# EAGLE design PGTN_daisy2_main_12cvin (EAGLE 9.6.0)
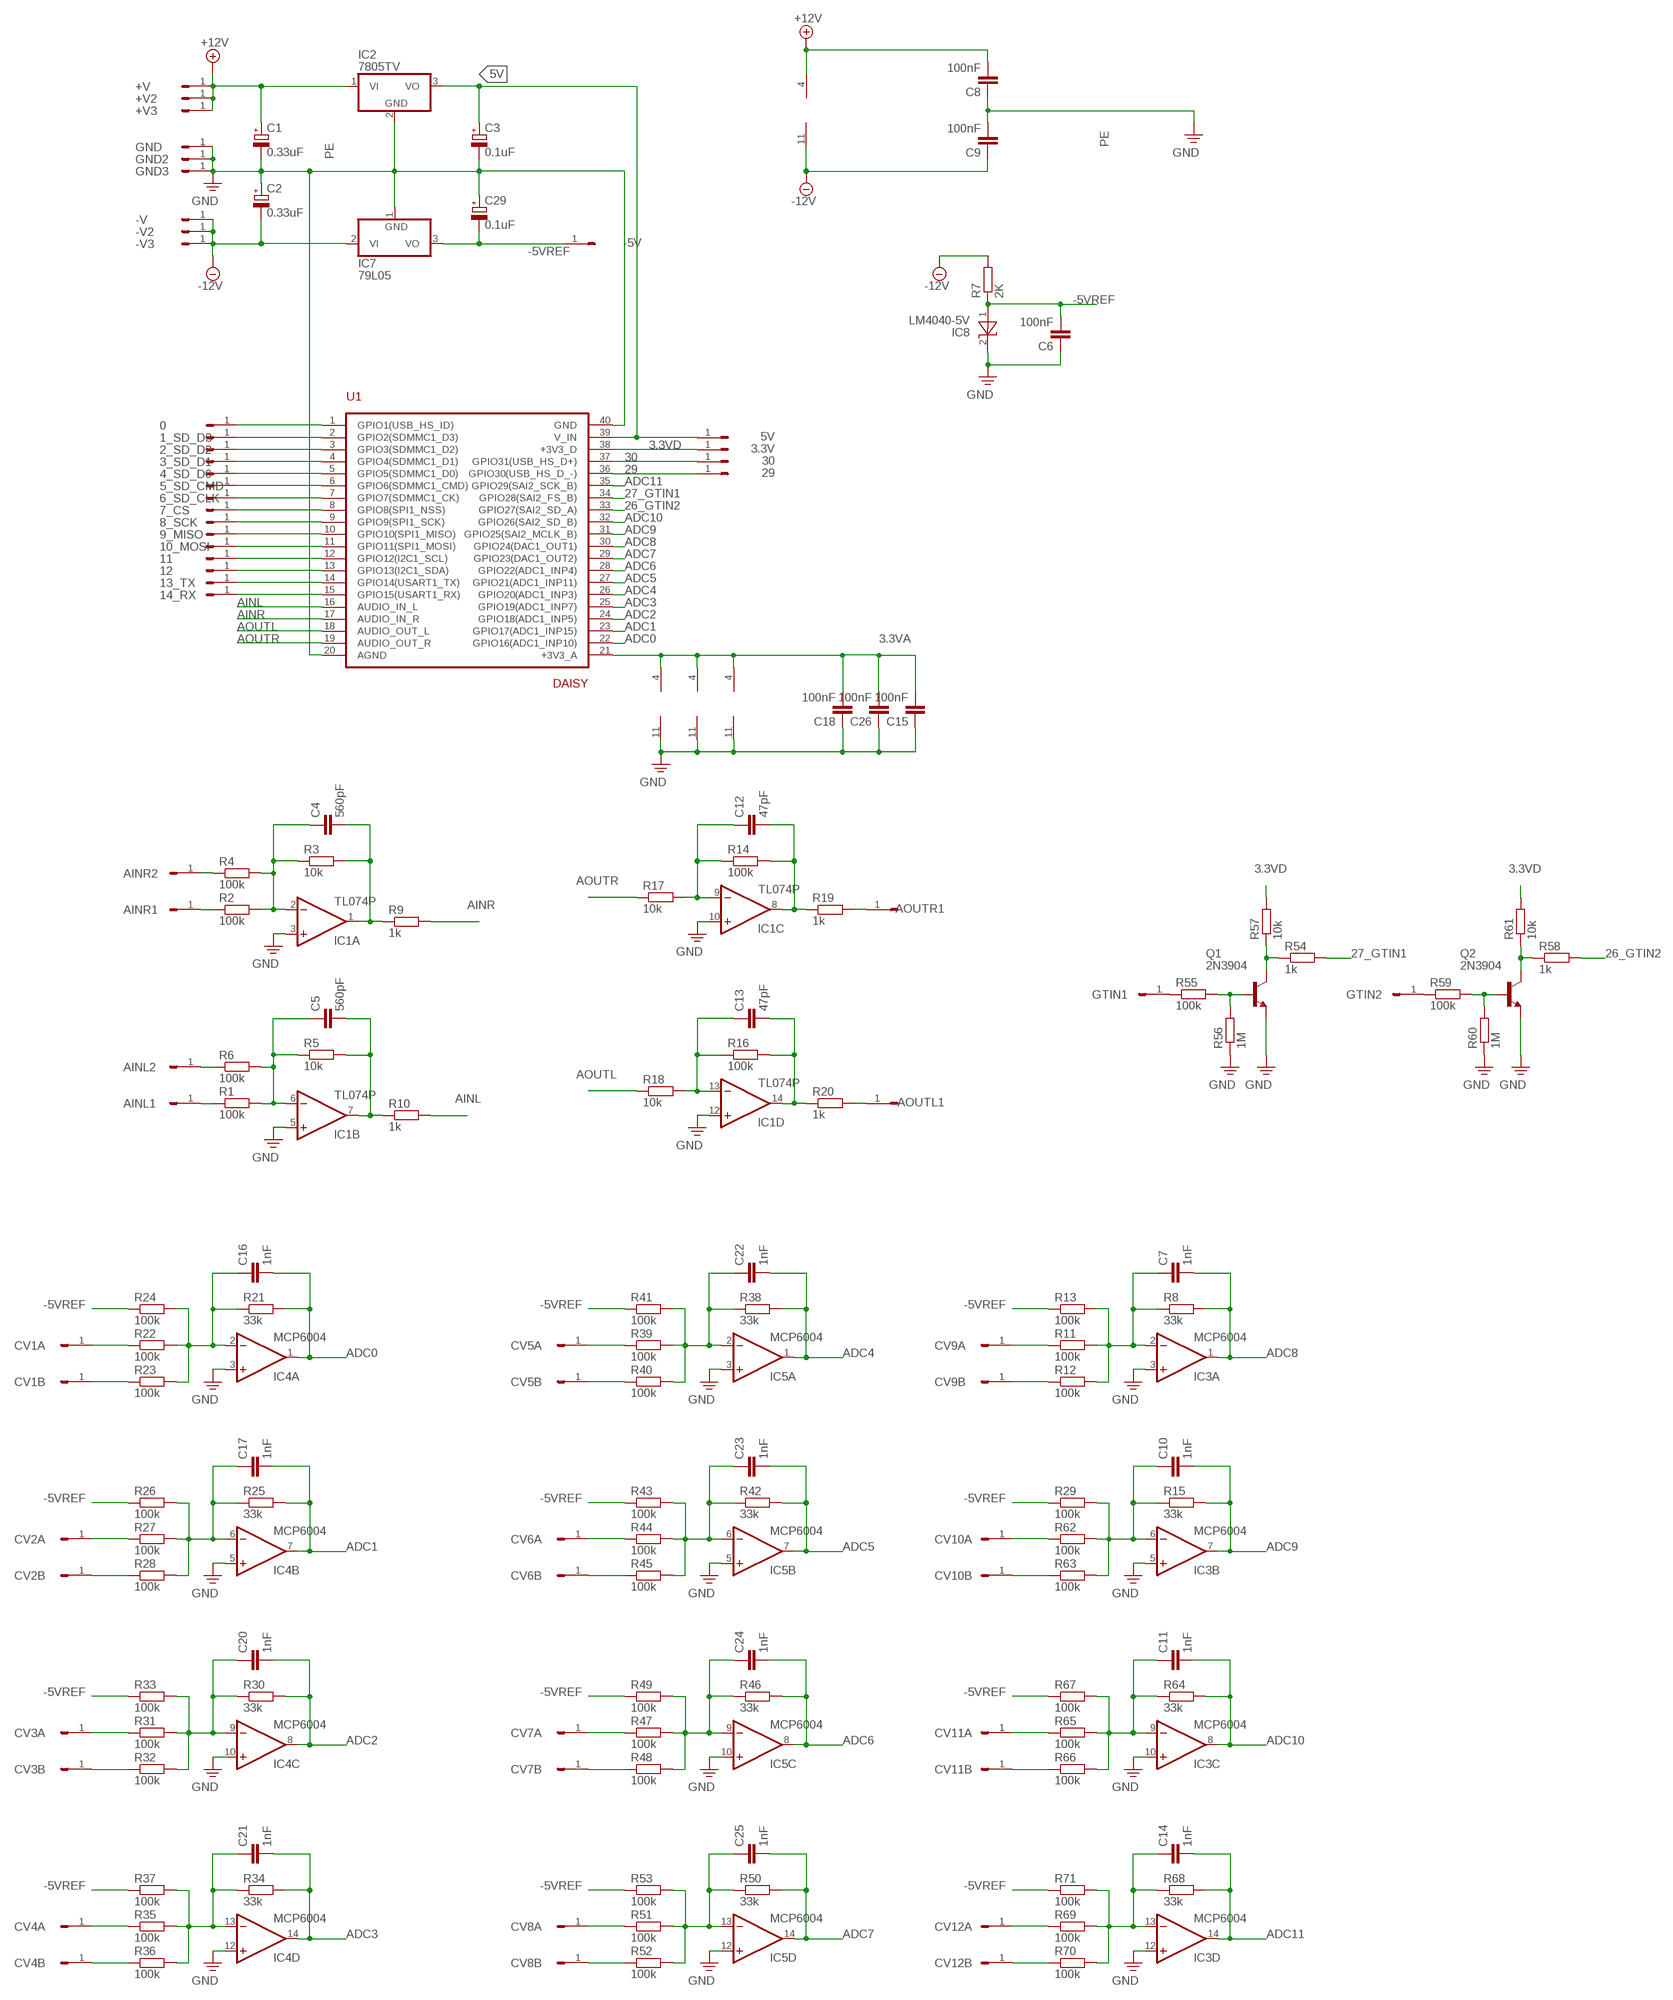
[diagram p0: schematic, sheet 1]

## Parts
0  HEADER/MALE/01  [HEADER/MALE/01]
1_SD_D3  HEADER/MALE/01  [HEADER/MALE/01]
2_SD_D2  HEADER/MALE/01  [HEADER/MALE/01]
3.3V  HEADER/MALE/01  [HEADER/MALE/01]
3_SD_D1  HEADER/MALE/01  [HEADER/MALE/01]
4_SD_D0  HEADER/MALE/01  [HEADER/MALE/01]
5_SD_CMD  HEADER/MALE/01  [HEADER/MALE/01]
5V  HEADER/MALE/01  [HEADER/MALE/01]
6_SD_CLK  HEADER/MALE/01  [HEADER/MALE/01]
7_CS  HEADER/MALE/01  [HEADER/MALE/01]
8_SCK  HEADER/MALE/01  [HEADER/MALE/01]
9_MISO  HEADER/MALE/01  [HEADER/MALE/01]
10_MOSI  HEADER/MALE/01  [HEADER/MALE/01]
11  HEADER/MALE/01  [HEADER/MALE/01]
12  HEADER/MALE/01  [HEADER/MALE/01]
13_TX  HEADER/MALE/01  [HEADER/MALE/01]
14_RX  HEADER/MALE/01  [HEADER/MALE/01]
29  HEADER/MALE/01  [HEADER/MALE/01]
30  HEADER/MALE/01  [HEADER/MALE/01]
+V  HEADER/MALE/01  [HEADER/MALE/01]
+V2  HEADER/MALE/01  [HEADER/MALE/01]
+V3  HEADER/MALE/01  [HEADER/MALE/01]
-5V  HEADER/MALE/01  [HEADER/MALE/01]
-V  HEADER/MALE/01  [HEADER/MALE/01]
-V2  HEADER/MALE/01  [HEADER/MALE/01]
-V3  HEADER/MALE/01  [HEADER/MALE/01]
AINL1  HEADER/MALE/01  [HEADER/MALE/01]
AINL2  HEADER/MALE/01  [HEADER/MALE/01]
AINR1  HEADER/MALE/01  [HEADER/MALE/01]
AINR2  HEADER/MALE/01  [HEADER/MALE/01]
AOUTL1  HEADER/MALE/01  [HEADER/MALE/01]
AOUTR1  HEADER/MALE/01  [HEADER/MALE/01]
C1  0.33uF  CAPACITOR/POLARIZEDE2.5-6  [E2,5-6]
C2  0.33uF  CAPACITOR/POLARIZEDE2.5-6  [E2,5-6]
C3  0.1uF  CAPACITOR/POLARIZEDE2.5-6  [E2,5-6]
C4  560pF  CAPACITORCERAMICDISC/5  [CERAMICDISC/5]
C5  560pF  CAPACITORCERAMICDISC/5  [CERAMICDISC/5]
C6  100nF  CAPACITORCERAMICDISC/5  [CERAMICDISC/5]
C7  1nF  CAPACITORCERAMICDISC/5  [CERAMICDISC/5]
C8  100nF  CAPACITORCERAMICDISC/5  [CERAMICDISC/5]
C9  100nF  CAPACITORCERAMICDISC/5  [CERAMICDISC/5]
C10  1nF  CAPACITORCERAMICDISC/5  [CERAMICDISC/5]
C11  1nF  CAPACITORCERAMICDISC/5  [CERAMICDISC/5]
C12  47pF  CAPACITORCERAMICDISC/5  [CERAMICDISC/5]
C13  47pF  CAPACITORCERAMICDISC/5  [CERAMICDISC/5]
C14  1nF  CAPACITORCERAMICDISC/5  [CERAMICDISC/5]
C15  100nF  CAPACITORCERAMICDISC/5  [CERAMICDISC/5]
C16  1nF  CAPACITORCERAMICDISC/5  [CERAMICDISC/5]
C17  1nF  CAPACITORCERAMICDISC/5  [CERAMICDISC/5]
C18  100nF  CAPACITORCERAMICDISC/5  [CERAMICDISC/5]
C20  1nF  CAPACITORCERAMICDISC/5  [CERAMICDISC/5]
C21  1nF  CAPACITORCERAMICDISC/5  [CERAMICDISC/5]
C22  1nF  CAPACITORCERAMICDISC/5  [CERAMICDISC/5]
C23  1nF  CAPACITORCERAMICDISC/5  [CERAMICDISC/5]
C24  1nF  CAPACITORCERAMICDISC/5  [CERAMICDISC/5]
C25  1nF  CAPACITORCERAMICDISC/5  [CERAMICDISC/5]
C26  100nF  CAPACITORCERAMICDISC/5  [CERAMICDISC/5]
C29  0.1uF  CAPACITOR/POLARIZEDE2.5-6  [E2,5-6]
CV1A  HEADER/MALE/01  [HEADER/MALE/01]
CV1B  HEADER/MALE/01  [HEADER/MALE/01]
CV2A  HEADER/MALE/01  [HEADER/MALE/01]
CV2B  HEADER/MALE/01  [HEADER/MALE/01]
CV3A  HEADER/MALE/01  [HEADER/MALE/01]
CV3B  HEADER/MALE/01  [HEADER/MALE/01]
CV4A  HEADER/MALE/01  [HEADER/MALE/01]
CV4B  HEADER/MALE/01  [HEADER/MALE/01]
CV5A  HEADER/MALE/01  [HEADER/MALE/01]
CV5B  HEADER/MALE/01  [HEADER/MALE/01]
CV6A  HEADER/MALE/01  [HEADER/MALE/01]
CV6B  HEADER/MALE/01  [HEADER/MALE/01]
CV7A  HEADER/MALE/01  [HEADER/MALE/01]
CV7B  HEADER/MALE/01  [HEADER/MALE/01]
CV8A  HEADER/MALE/01  [HEADER/MALE/01]
CV8B  HEADER/MALE/01  [HEADER/MALE/01]
CV9A  HEADER/MALE/01  [HEADER/MALE/01]
CV9B  HEADER/MALE/01  [HEADER/MALE/01]
CV10A  HEADER/MALE/01  [HEADER/MALE/01]
CV10B  HEADER/MALE/01  [HEADER/MALE/01]
CV11A  HEADER/MALE/01  [HEADER/MALE/01]
CV11B  HEADER/MALE/01  [HEADER/MALE/01]
CV12A  HEADER/MALE/01  [HEADER/MALE/01]
CV12B  HEADER/MALE/01  [HEADER/MALE/01]
GND  HEADER/MALE/01  [HEADER/MALE/01]
GND2  HEADER/MALE/01  [HEADER/MALE/01]
GND3  HEADER/MALE/01  [HEADER/MALE/01]
GTIN1  HEADER/MALE/01  [HEADER/MALE/01]
GTIN2  HEADER/MALE/01  [HEADER/MALE/01]
IC1  TL074P  [DIL14]
IC2  7805TV  [TO220V]
IC3  MCP6004  TL074P  [DIL14]
IC4  MCP6004  TL074P  [DIL14]
IC5  MCP6004  TL074P  [DIL14]
IC7  79L05  79L05Z  [TO92]
IC8  LM4040-5V  LM4040  [TO92]
Q1  2N3904  [TO92]
Q2  2N3904  [TO92]
R1  100k  RESISTORRESISTOR/UPRIGHT/7.5  [RESISTOR/7.5]
R2  100k  RESISTORRESISTOR/UPRIGHT/7.5  [RESISTOR/7.5]
R3  10k  RESISTORRESISTOR/UPRIGHT/7.5  [RESISTOR/7.5]
R4  100k  RESISTORRESISTOR/UPRIGHT/7.5  [RESISTOR/7.5]
R5  10k  RESISTORRESISTOR/UPRIGHT/7.5  [RESISTOR/7.5]
R6  100k  RESISTORRESISTOR/UPRIGHT/7.5  [RESISTOR/7.5]
R7  2K  RESISTORRESISTOR/UPRIGHT/7.5  [RESISTOR/7.5]
R8  33k  RESISTORRESISTOR/UPRIGHT/7.5  [RESISTOR/7.5]
R9  1k  RESISTORRESISTOR/UPRIGHT/7.5  [RESISTOR/7.5]
R10  1k  RESISTORRESISTOR/UPRIGHT/7.5  [RESISTOR/7.5]
R11  100k  RESISTORRESISTOR/UPRIGHT/7.5  [RESISTOR/7.5]
R12  100k  RESISTORRESISTOR/UPRIGHT/7.5  [RESISTOR/7.5]
R13  100k  RESISTORRESISTOR/UPRIGHT/7.5  [RESISTOR/7.5]
R14  100k  RESISTORRESISTOR/UPRIGHT/7.5  [RESISTOR/7.5]
R15  33k  RESISTORRESISTOR/UPRIGHT/7.5  [RESISTOR/7.5]
R16  100k  RESISTORRESISTOR/UPRIGHT/7.5  [RESISTOR/7.5]
R17  10k  RESISTORRESISTOR/UPRIGHT/7.5  [RESISTOR/7.5]
R18  10k  RESISTORRESISTOR/UPRIGHT/7.5  [RESISTOR/7.5]
R19  1k  RESISTORRESISTOR/UPRIGHT/7.5  [RESISTOR/7.5]
R20  1k  RESISTORRESISTOR/UPRIGHT/7.5  [RESISTOR/7.5]
R21  33k  RESISTORRESISTOR/UPRIGHT/7.5  [RESISTOR/7.5]
R22  100k  RESISTORRESISTOR/UPRIGHT/7.5  [RESISTOR/7.5]
R23  100k  RESISTORRESISTOR/UPRIGHT/7.5  [RESISTOR/7.5]
R24  100k  RESISTORRESISTOR/UPRIGHT/7.5  [RESISTOR/7.5]
R25  33k  RESISTORRESISTOR/UPRIGHT/7.5  [RESISTOR/7.5]
R26  100k  RESISTORRESISTOR/UPRIGHT/7.5  [RESISTOR/7.5]
R27  100k  RESISTORRESISTOR/UPRIGHT/7.5  [RESISTOR/7.5]
R28  100k  RESISTORRESISTOR/UPRIGHT/7.5  [RESISTOR/7.5]
R29  100k  RESISTORRESISTOR/UPRIGHT/7.5  [RESISTOR/7.5]
R30  33k  RESISTORRESISTOR/UPRIGHT/7.5  [RESISTOR/7.5]
R31  100k  RESISTORRESISTOR/UPRIGHT/7.5  [RESISTOR/7.5]
R32  100k  RESISTORRESISTOR/UPRIGHT/7.5  [RESISTOR/7.5]
R33  100k  RESISTORRESISTOR/UPRIGHT/7.5  [RESISTOR/7.5]
R34  33k  RESISTORRESISTOR/UPRIGHT/7.5  [RESISTOR/7.5]
R35  100k  RESISTORRESISTOR/UPRIGHT/7.5  [RESISTOR/7.5]
R36  100k  RESISTORRESISTOR/UPRIGHT/7.5  [RESISTOR/7.5]
R37  100k  RESISTORRESISTOR/UPRIGHT/7.5  [RESISTOR/7.5]
R38  33k  RESISTORRESISTOR/UPRIGHT/7.5  [RESISTOR/7.5]
R39  100k  RESISTORRESISTOR/UPRIGHT/7.5  [RESISTOR/7.5]
R40  100k  RESISTORRESISTOR/UPRIGHT/7.5  [RESISTOR/7.5]
R41  100k  RESISTORRESISTOR/UPRIGHT/7.5  [RESISTOR/7.5]
R42  33k  RESISTORRESISTOR/UPRIGHT/7.5  [RESISTOR/7.5]
R43  100k  RESISTORRESISTOR/UPRIGHT/7.5  [RESISTOR/7.5]
R44  100k  RESISTORRESISTOR/UPRIGHT/7.5  [RESISTOR/7.5]
R45  100k  RESISTORRESISTOR/UPRIGHT/7.5  [RESISTOR/7.5]
R46  33k  RESISTORRESISTOR/UPRIGHT/7.5  [RESISTOR/7.5]
R47  100k  RESISTORRESISTOR/UPRIGHT/7.5  [RESISTOR/7.5]
R48  100k  RESISTORRESISTOR/UPRIGHT/7.5  [RESISTOR/7.5]
R49  100k  RESISTORRESISTOR/UPRIGHT/7.5  [RESISTOR/7.5]
R50  33k  RESISTORRESISTOR/UPRIGHT/7.5  [RESISTOR/7.5]
R51  100k  RESISTORRESISTOR/UPRIGHT/7.5  [RESISTOR/7.5]
R52  100k  RESISTORRESISTOR/UPRIGHT/7.5  [RESISTOR/7.5]
R53  100k  RESISTORRESISTOR/UPRIGHT/7.5  [RESISTOR/7.5]
R54  1k  RESISTORRESISTOR/UPRIGHT/7.5  [RESISTOR/7.5]
R55  100k  RESISTORRESISTOR/UPRIGHT/7.5  [RESISTOR/7.5]
R56  1M  RESISTORRESISTOR/UPRIGHT/7.5  [RESISTOR/7.5]
R57  10k  RESISTORRESISTOR/UPRIGHT/7.5  [RESISTOR/7.5]
R58  1k  RESISTORRESISTOR/UPRIGHT/7.5  [RESISTOR/7.5]
R59  100k  RESISTORRESISTOR/UPRIGHT/7.5  [RESISTOR/7.5]
R60  1M  RESISTORRESISTOR/UPRIGHT/7.5  [RESISTOR/7.5]
R61  10k  RESISTORRESISTOR/UPRIGHT/7.5  [RESISTOR/7.5]
R62  100k  RESISTORRESISTOR/UPRIGHT/7.5  [RESISTOR/7.5]
R63  100k  RESISTORRESISTOR/UPRIGHT/7.5  [RESISTOR/7.5]
R64  33k  RESISTORRESISTOR/UPRIGHT/7.5  [RESISTOR/7.5]
R65  100k  RESISTORRESISTOR/UPRIGHT/7.5  [RESISTOR/7.5]
R66  100k  RESISTORRESISTOR/UPRIGHT/7.5  [RESISTOR/7.5]
R67  100k  RESISTORRESISTOR/UPRIGHT/7.5  [RESISTOR/7.5]
R68  33k  RESISTORRESISTOR/UPRIGHT/7.5  [RESISTOR/7.5]
R69  100k  RESISTORRESISTOR/UPRIGHT/7.5  [RESISTOR/7.5]
R70  100k  RESISTORRESISTOR/UPRIGHT/7.5  [RESISTOR/7.5]
R71  100k  RESISTORRESISTOR/UPRIGHT/7.5  [RESISTOR/7.5]
U1  DAISY  ES_DAISY_SEED_REV4  [ES_DAISY_SEED]

## Nets
3.3VA: C15.2 C18.2 C26.2 IC3.4(P:V+) IC4.4(P:V+) IC5.4(P:V+) U1.21(+3V3_A)
3.3VD: 3.3V.1 R57.2 R61.2 U1.38(+3V3_D)
5V: 5V.1 C3.+ IC2.3(VO) U1.39(V_IN)
26_GTIN2: R58.2 U1.33(GPIO27(SAI2_SD_A))
27_GTIN1: R54.2 U1.34(GPIO28(SAI2_FS_B))
29: 29.1 U1.36(GPIO30(USB_HS_D_-))
30: 30.1 U1.37(GPIO31(USB_HS_D+))
+12V: +V2.1 +V3.1 +V.1 C1.+ C8.2 IC1.4(P:V+) IC2.1(VI)
-5VREF: -5V.1 C6.2 C29.- IC7.3(VO) IC8.1(A) R7.1 R13.1 R24.1 R26.1 R29.1 R33.1 R37.1 R41.1 R43.1 R49.1 R53.1 R67.1 R71.1
-12V: -V2.1 -V3.1 -V.1 C2.- C9.1 IC1.11(P:V-) IC7.2(VI) R7.2
ADC0: C16.2 IC4.1(A:OUT) R21.2 U1.22(GPIO16(ADC1_INP10))
ADC1: C17.2 IC4.7(B:OUT) R25.2 U1.23(GPIO17(ADC1_INP15))
ADC2: C20.2 IC4.8(C:OUT) R30.2 U1.24(GPIO18(ADC1_INP5))
ADC3: C21.2 IC4.14(D:OUT) R34.2 U1.25(GPIO19(ADC1_INP7))
ADC4: C22.2 IC5.1(A:OUT) R38.2 U1.26(GPIO20(ADC1_INP3))
ADC5: C23.2 IC5.7(B:OUT) R42.2 U1.27(GPIO21(ADC1_INP11))
ADC6: C24.2 IC5.8(C:OUT) R46.2 U1.28(GPIO22(ADC1_INP4))
ADC7: C25.2 IC5.14(D:OUT) R50.2 U1.29(GPIO23(DAC1_OUT2))
ADC8: C7.2 IC3.1(A:OUT) R8.2 U1.30(GPIO24(DAC1_OUT1))
ADC9: C10.2 IC3.7(B:OUT) R15.2 U1.31(GPIO25(SAI2_MCLK_B))
ADC10: C11.2 IC3.8(C:OUT) R64.2 U1.32(GPIO26(SAI2_SD_B))
ADC11: C14.2 IC3.14(D:OUT) R68.2 U1.35(GPIO29(SAI2_SCK_B))
AINL: R10.2 U1.16(AUDIO_IN_L)
AINR: R9.2 U1.17(AUDIO_IN_R)
AOUTL: R18.1 U1.18(AUDIO_OUT_L)
AOUTR: R17.1 U1.19(AUDIO_OUT_R)
N$1: CV2A.1 R27.1
N$2: AINR2.1 R4.1
N$3: AINL2.1 R6.1
N$4: C4.1 IC1.2(A:-IN) R2.2 R3.1 R4.2
N$5: C5.1 IC1.6(B:-IN) R1.2 R5.1 R6.2
N$6: AINR1.1 R2.1
N$7: AINL1.1 R1.1
N$8: C7.1 IC3.2(A:-IN) R8.1 R11.2 R12.2 R13.2
N$9: C5.2 IC1.7(B:OUT) R5.2 R10.1
N$10: C4.2 IC1.1(A:OUT) R3.2 R9.1
N$11: AOUTR1.1 R19.2
N$12: C12.2 IC1.8(C:OUT) R14.2 R19.1
N$13: CV9B.1 R12.1
N$14: CV9A.1 R11.1
N$15: C13.2 IC1.14(D:OUT) R16.2 R20.1
N$16: C10.1 IC3.6(B:-IN) R15.1 R29.2 R62.2 R63.2
N$17: C13.1 IC1.13(D:-IN) R16.1 R18.2
N$18: CV10A.1 R62.1
N$19: CV10B.1 R63.1
N$20: C12.1 IC1.9(C:-IN) R14.1 R17.2
N$21: AOUTL1.1 R20.2
N$22: CV1A.1 R22.1
N$23: 14_RX.1 U1.15(GPIO15(USART1_RX))
N$24: C16.1 IC4.2(A:-IN) R21.1 R22.2 R23.2 R24.2
N$25: GTIN2.1 R59.1
N$26: CV2B.1 R28.1
N$27: CV1B.1 R23.1
N$28: 13_TX.1 U1.14(GPIO14(USART1_TX))
N$29: C17.1 IC4.6(B:-IN) R25.1 R26.2 R27.2 R28.2
N$30: C21.1 IC4.13(D:-IN) R34.1 R35.2 R36.2 R37.2
N$31: CV4A.1 R35.1
N$32: CV4B.1 R36.1
N$33: 10_MOSI.1 U1.11(GPIO11(SPI1_MOSI))
N$34: CV3B.1 R32.1
N$35: CV3A.1 R31.1
N$36: C20.1 IC4.9(C:-IN) R30.1 R31.2 R32.2 R33.2
N$37: 9_MISO.1 U1.10(GPIO10(SPI1_MISO))
N$38: C22.1 IC5.2(A:-IN) R38.1 R39.2 R40.2 R41.2
N$39: 8_SCK.1 U1.9(GPIO9(SPI1_SCK))
N$40: CV5B.1 R40.1
N$41: CV5A.1 R39.1
N$42: 7_CS.1 U1.8(GPIO8(SPI1_NSS))
N$43: C23.1 IC5.6(B:-IN) R42.1 R43.2 R44.2 R45.2
N$44: CV6A.1 R44.1
N$45: CV6B.1 R45.1
N$46: C25.1 IC5.13(D:-IN) R50.1 R51.2 R52.2 R53.2
N$47: 6_SD_CLK.1 U1.7(GPIO7(SDMMC1_CK))
N$48: CV8A.1 R51.1
N$49: CV8B.1 R52.1
N$50: CV7B.1 R48.1
N$51: CV7A.1 R47.1
N$52: C24.1 IC5.9(C:-IN) R46.1 R47.2 R48.2 R49.2
N$53: 5_SD_CMD.1 U1.6(GPIO6(SDMMC1_CMD))
N$54: GTIN1.1 R55.1
N$55: Q1.2(B) R55.2 R56.2
N$56: Q1.1(C) R54.1 R57.1
N$57: C14.1 IC3.13(D:-IN) R68.1 R69.2 R70.2 R71.2
N$58: Q2.2(B) R59.2 R60.2
N$59: Q2.1(C) R58.1 R61.1
N$60: CV12A.1 R69.1
N$61: 4_SD_D0.1 U1.5(GPIO5(SDMMC1_D0))
N$62: 3_SD_D1.1 U1.4(GPIO4(SDMMC1_D1))
N$63: 2_SD_D2.1 U1.3(GPIO3(SDMMC1_D2))
N$64: 1_SD_D3.1 U1.2(GPIO2(SDMMC1_D3))
N$65: 0.1 U1.1(GPIO1(USB_HS_ID))
N$66: 11.1 U1.12(GPIO12(I2C1_SCL))
N$67: 12.1 U1.13(GPIO13(I2C1_SDA))
N$68: CV12B.1 R70.1
N$69: CV11B.1 R66.1
N$70: CV11A.1 R65.1
N$71: C11.1 IC3.9(C:-IN) R64.1 R65.2 R66.2 R67.2
PE: C1.- C2.+ C3.- C6.1 C8.1 C9.2 C15.1 C18.1 C26.1 C29.+ GND2.1 GND3.1 GND.1 IC1.3(A:+IN) IC1.5(B:+IN) IC1.10(C:+IN) IC1.12(D:+IN) IC2.2(GND) IC3.3(A:+IN) IC3.5(B:+IN) IC3.10(C:+IN) IC3.11(P:V-) IC3.12(D:+IN) IC4.3(A:+IN) IC4.5(B:+IN) IC4.10(C:+IN) IC4.11(P:V-) IC4.12(D:+IN) IC5.3(A:+IN) IC5.5(B:+IN) IC5.10(C:+IN) IC5.11(P:V-) IC5.12(D:+IN) IC7.1(GND) IC8.2(C) Q1.3(E) Q2.3(E) R56.1 R60.1 U1.20(AGND) U1.40(GND) ; supply symbol labelled GND

## Library data of the parts
0 1_SD_D3 2_SD_D2 3.3V 3_SD_D1 4_SD_D0 5_SD_CMD 5V 6_SD_CLK 7_CS 8_SCK 9_MISO 10_MOSI 11 12 13_TX 14_RX 29 30 +V +V2 +V3 -5V -V -V2 -V3 AINL1 AINL2 AINR1 AINR2 AOUTL1 AOUTR1 CV1A CV1B CV2A CV2B CV3A CV3B CV4A CV4B CV5A CV5B CV6A CV6B CV7A CV7B CV8A CV8B CV9A CV9B CV10A CV10B CV11A CV11B CV12A CV12B GND GND2 GND3 GTIN1 GTIN2 = connectors:HEADER/MALE/01; SPICEPREFIX: X
C1-C3 C29 = capacitors:CAPACITOR/POLARIZED: POLARIZED CAPACITOR, European symbol; SPICEPREFIX: C
C4-C18 C20-C26 = capacitors:CAPACITOR: CAPACITOR, European symbol
IC1 IC3-IC5 = ic_analogue:TL074: OP AMP
IC2 = ic_voltage_reg:78*: Positive VOLTAGE REGULATOR Source: http://cache.national.com/ds/LM/LM78L05.pdf http://www.fairchildsemi.com/ds/LM/LM7805.pdf
IC7 = linear:79*: Negative VOLTAGE REGULATOR
IC8 = ic_voltage_reg:LM4040
Q1 Q2 = transistors:2N3904: NPN Transistor
R1-R71 = resistors:RESISTOR: RESISTOR, European symbol
U1 = Electrosmith-Boards:ES_DAISY_SEED_REV4; IPN: Daisy Seed

## Board
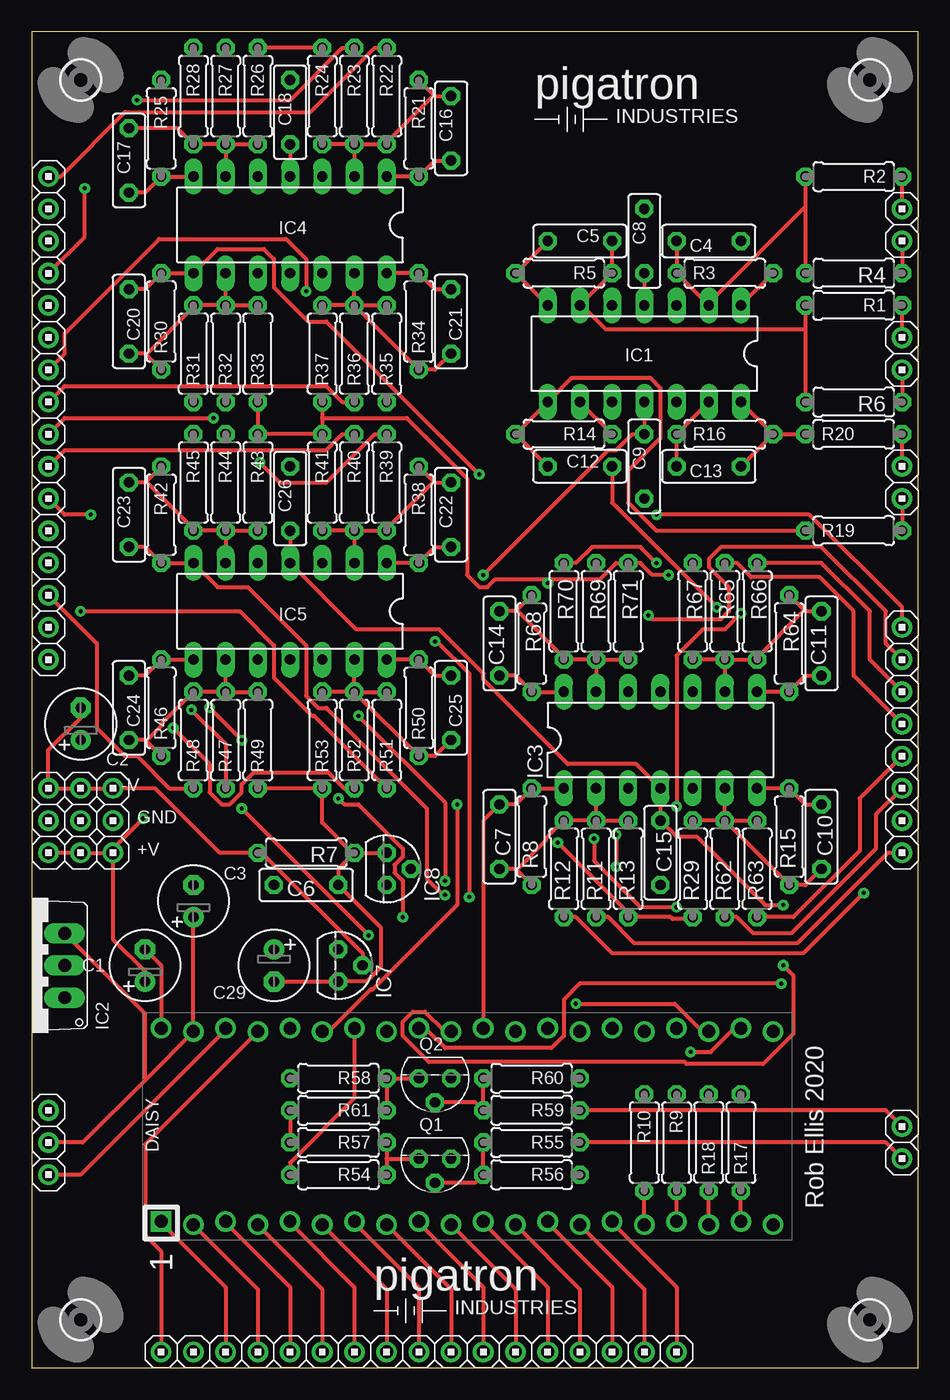
[diagram p1: board, top side]
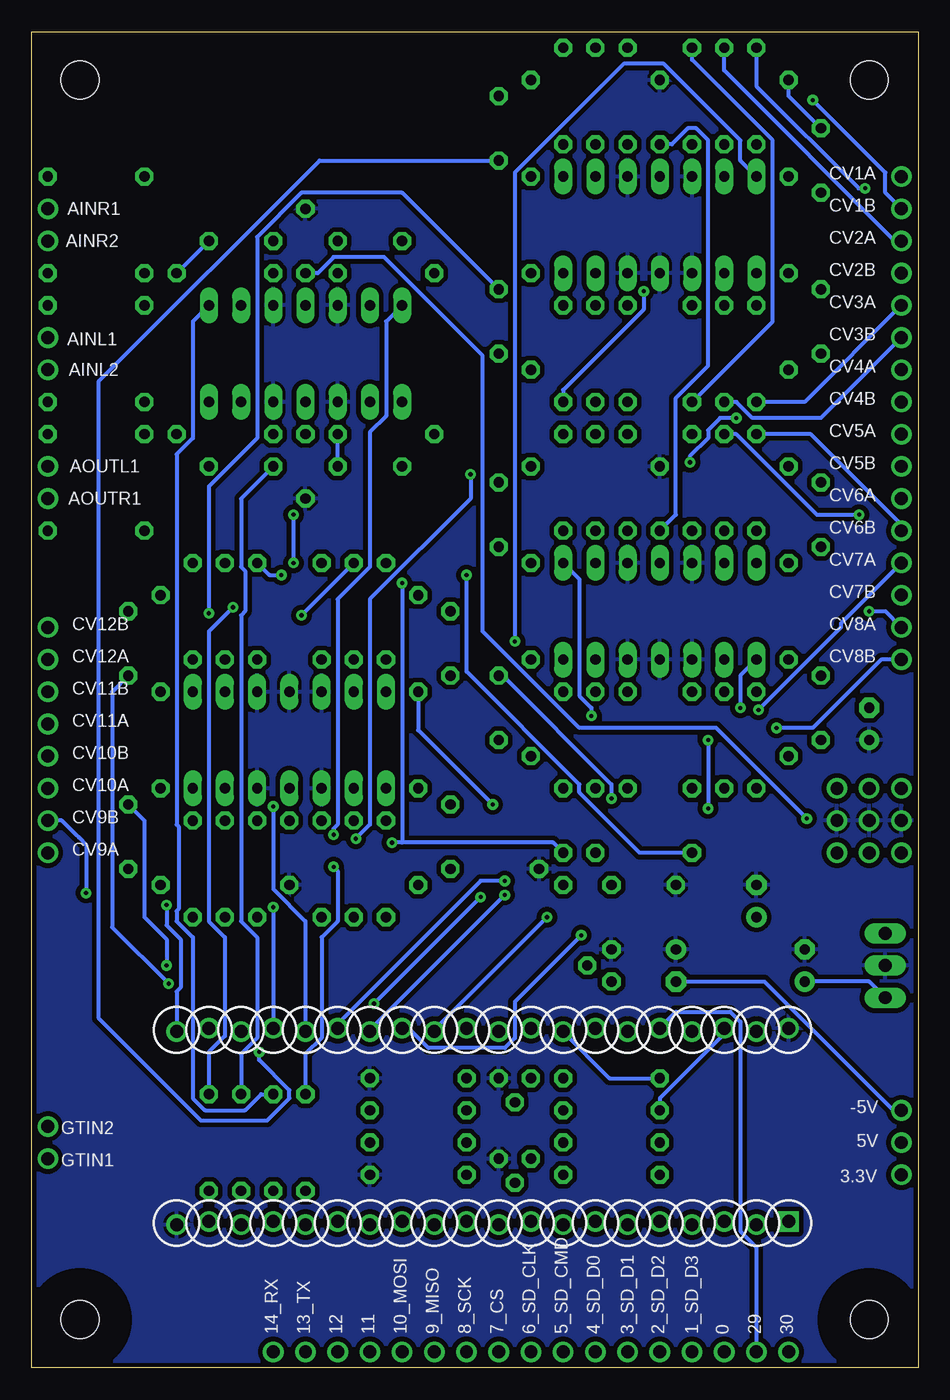
[diagram p2: board, bottom side, seen from below]

Size 69.9 x 105.4 mm. Coordinates in mm from the lower left corner, seen from the top.
Outline: 69.9,105.4 0,105.4 0,0 69.9,0 69.9,105.4
Copper layers (1*16): Top 0.0356mm / dielectric 1.5011mm / Bottom 0.0356mm
Design rules "pigatron": minimum track width 12mil, minimum drill 13mil, track to track 15mil, track to pad 10mil, pad to pad 10mil, via to via 10mil, smd to smd 6mil, copper to edge 15mil, drill to drill 10mil, minimum pad ring 12mil, minimum via ring 10mil, stop-mask expansion 4mil, vias tented up to drill 0mil, thermal gap 10mil

### Footprints (pad centres in the part's own frame; a part is rotated, then mirrored left to right if it is on the bottom)
HEADER/MALE/01 = drill 1.016: 1 0,0
E2,5-6 = drill 0.813 pad 1.6: + -1.27,0 | drill 0.813 pad 1.6 octagon: - 1.27,0
CERAMICDISC/5 = drill 0.813 octagon: 1 -2.54,0; 2 2.54,0
DIL14 = drill 0.813 long: 1 -7.62,-3.81; 2 -5.08,-3.81; 3 -2.54,-3.81; 4 0,-3.81; 5 2.54,-3.81; 6 5.08,-3.81; 7 7.62,-3.81; 8 7.62,3.81; 9 5.08,3.81; 10 2.54,3.81; 11 0,3.81; 12 -2.54,3.81; 13 -5.08,3.81; 14 -7.62,3.81
TO220V = drill 1.016 long: 1 -2.54,-2.54; 2 0,-2.54; 3 2.54,-2.54
TO92 = drill 0.813 octagon: 1 -1.27,0; 2 0,1.905; 3 1.27,0
TO92' = drill 0.813 octagon: 1 1.27,0; 2 0,1.905; 3 -1.27,0
RESISTOR/7.5 = drill 0.813 octagon: 1 -3.81,0; 2 3.81,0
ES_DAISY_SEED = drill 1.016 square: 1 -7.493,24.13 | drill 1.016: 2 -7.747,21.59; 3 -7.493,19.05; 4 -7.747,16.51; 5 -7.493,13.97; 6 -7.747,11.43; 7 -7.493,8.89; 8 -7.747,6.35; 9 -7.493,3.81; 10 -7.747,1.27; 11 -7.493,-1.27; 12 -7.747,-3.81; 13 -7.493,-6.35; 14 -7.747,-8.89; 15 -7.493,-11.43; 16 -7.747,-13.97; 17 -7.493,-16.51; 18 -7.747,-19.05; 19 -7.493,-21.59; 20 -7.747,-24.13; 21 7.493,-24.13; 22 7.747,-21.59; 23 7.493,-19.05; 24 7.747,-16.51; 25 7.493,-13.97; 26 7.747,-11.43; 27 7.493,-8.89; 28 7.747,-6.35; 29 7.493,-3.81; 30 7.747,-1.27; 31 7.493,1.27; 32 7.747,3.81; 33 7.493,6.35; 34 7.747,8.89; 35 7.493,11.43; 36 7.747,13.97; 37 7.493,16.51; 38 7.747,19.05; 39 7.493,21.59; 40 7.747,24.13
STANDOFF/3.0 = hole 3: 0,0

### Placement (x,y rotation side)
0  15.29,1.26 90 top
1_SD_D3  17.83,1.26 90 top
2_SD_D2  20.37,1.26 90 top
3.3V  1.32,15.23 270 top
3_SD_D1  22.91,1.26 90 top
4_SD_D0  25.45,1.26 90 top
5_SD_CMD  27.99,1.26 90 top
5V  1.32,17.77 180 top
6_SD_CLK  30.53,1.26 90 top
7_CS  33.07,1.26 90 top
8_SCK  35.61,1.26 90 top
9_MISO  38.15,1.26 90 top
10_MOSI  40.69,1.26 90 top
11  43.23,1.26 90 top
12  45.77,1.26 90 top
13_TX  48.31,1.26 90 top
14_RX  50.85,1.26 90 top
29  12.75,1.26 90 top
30  10.21,1.26 90 top
+V  6.4,40.63 0 top
+V2  3.86,40.63 180 top
+V3  1.32,40.63 180 top
-5V  1.32,20.31 0 top
-V  6.4,45.71 0 top
-V2  3.86,45.71 180 top
-V3  1.32,45.71 180 top
AINL1  68.63,81.27 180 top
AINL2  68.63,78.73 180 top
AINR1  68.63,91.43 180 top
AINR2  68.63,88.89 180 top
AOUTL1  68.63,71.11 180 top
AOUTR1  68.63,68.57 180 top
C1  8.94,31.74 90 top
C2  3.86,50.79 90 top
C3  12.75,36.82 90 top
C4  53.39,88.89 0 top
C5  43.23,88.89 180 top
C6  21.64,38.09 0 top
C7  36.88,41.9 90 top
C8  48.31,88.89 270 top
C9  48.31,71.11 270 top
C10  62.28,41.9 90 top
C11  62.28,57.14 270 top
C12  43.23,71.11 180 top
C13  53.39,71.11 0 top
C14  36.88,57.14 270 top
C15  49.58,40.63 90 top
C16  33.07,97.78 270 top
C17  7.67,95.24 270 top
C18  20.37,99.05 270 top
C20  7.67,82.54 90 top
C21  33.07,82.54 90 top
C22  33.07,67.3 270 top
C23  7.67,67.3 270 top
C24  7.67,52.06 90 top
C25  33.07,52.06 90 top
C26  20.37,68.57 270 top
C29  19.1,31.74 270 top
CV1A  1.32,93.97 0 top
CV1B  1.32,91.43 0 top
CV2A  1.32,88.89 0 top
CV2B  1.32,86.35 0 top
CV3A  1.32,83.81 0 top
CV3B  1.32,81.27 0 top
CV4A  1.32,78.73 0 top
CV4B  1.32,76.19 0 top
CV5A  1.32,73.65 0 top
CV5B  1.32,71.11 0 top
CV6A  1.32,68.57 0 top
CV6B  1.32,66.03 0 top
CV7A  1.32,63.49 0 top
CV7B  1.32,60.95 0 top
CV8A  1.32,58.41 0 top
CV8B  1.32,55.87 0 top
CV9A  68.63,40.63 0 top
CV9B  68.63,43.17 0 top
CV10A  68.63,45.71 0 top
CV10B  68.63,48.25 0 top
CV11A  68.63,50.79 0 top
CV11B  68.63,53.33 0 top
CV12A  68.63,55.87 0 top
CV12B  68.63,58.41 0 top
GND  6.4,43.17 0 top
GND2  1.32,43.17 180 top
GND3  3.86,43.17 180 top
GTIN1  68.63,16.5 180 top
GTIN2  68.63,19.04 180 top
IC1  48.31,80 180 top
IC2  0.05,31.74 90 top
IC3  49.58,49.52 0 top
IC4  20.37,90.16 180 top
IC5  20.37,59.68 180 top
IC7  24.18,31.74 270 top
IC8  27.99,39.36 270 top
Q1  2N3904  [TO92']  31.8,16.5 180 top
Q2  2N3904  [TO92']  31.8,22.85 180 top
R1  64.82,83.81 180 top
R2  64.82,93.97 180 top
R3  54.66,86.35 0 top
R4  64.82,86.35 180 top
R5  41.96,86.35 180 top
R6  64.82,76.19 180 top
R7  21.64,40.63 180 top
R8  39.42,41.9 90 top
R9  50.85,17.77 270 top
R10  48.31,17.77 270 top
R11  44.5,39.36 90 top
R12  41.96,39.36 90 top
R13  47.04,39.36 90 top
R14  41.96,73.65 180 top
R15  59.74,41.9 90 top
R16  54.66,73.65 0 top
R17  55.93,17.77 90 top
R18  53.39,17.77 90 top
R19  64.82,66.03 0 top
R20  64.82,73.65 0 top
R21  30.53,97.78 270 top
R22  27.99,100.32 270 top
R23  25.45,100.32 270 top
R24  22.91,100.32 270 top
R25  10.21,97.78 270 top
R26  17.83,100.32 270 top
R27  15.29,100.32 270 top
R28  12.75,100.32 270 top
R29  52.12,39.36 90 top
R30  10.21,82.54 90 top
R31  12.75,80 90 top
R32  15.29,80 90 top
R33  17.83,80 90 top
R34  30.53,82.54 90 top
R35  27.99,80 90 top
R36  25.45,80 90 top
R37  22.91,80 90 top
R38  30.53,67.3 270 top
R39  27.99,69.84 270 top
R40  25.45,69.84 270 top
R41  22.91,69.84 270 top
R42  10.21,67.3 270 top
R43  17.83,69.84 270 top
R44  15.29,69.84 270 top
R45  12.75,69.84 270 top
R46  10.21,52.06 90 top
R47  15.29,49.52 90 top
R48  12.75,49.52 90 top
R49  17.83,49.52 90 top
R50  30.53,52.06 90 top
R51  27.99,49.52 90 top
R52  25.45,49.52 90 top
R53  22.91,49.52 90 top
R54  24.18,15.23 180 top
R55  39.42,17.77 180 top
R56  39.42,15.23 180 top
R57  24.18,17.77 180 top
R58  24.18,22.85 180 top
R59  39.42,20.31 180 top
R60  39.42,22.85 180 top
R61  24.18,20.31 180 top
R62  54.66,39.36 90 top
R63  57.2,39.36 90 top
R64  59.74,57.14 270 top
R65  54.66,59.68 270 top
R66  57.2,59.68 270 top
R67  52.12,59.68 270 top
R68  39.42,57.14 270 top
R69  44.5,59.68 270 top
R70  41.96,59.68 270 top
R71  47.04,59.68 270 top
U1  34.34,19.04 90 top
U$1  [PIGATRON-LOGO]  35.87,6.09 0 top
U$2  [STANDOFF/3.0]  66.09,3.8 180 top
U$3  [STANDOFF/3.0]  3.86,3.8 180 top
U$4  [STANDOFF/3.0]  3.86,101.59 0 top
U$5  [PIGATRON-LOGO]  48.57,100.07 0 top
U$7  [STANDOFF/3.0]  66.09,101.59 0 top

### Tracks (layer width: path | path; a pad name or v marks a point on that pad's centre or on a via)
3.3VA  (via drill 0.33)
  Top 0.305: C18.2 IC4.4 | C26.2 IC5.4 25.61,58.25 32.12,58.25 35.61,54.76 35.61,54.28 42.28,47.62 47.68,47.62 IC3.4 C15.2 50.85,41.9 52.44,41.9 57.84,36.5 v59.27,36.5
  Bottom 0.305: U1.21 58.47,29.68 58.15,29.99 58.15,33.8 59.27,34.91 v59.27,36.5 | C18.2 19.42,96.51 18.15,97.78 17.51,97.78 16.56,96.83 16.56,79.05 19.1,76.51 19.1,67.3 C26.2
3.3VD
  Top 0.305: R61.2 R57.2 | 3.3V.1 3.86,15.23 15.29,26.66 U1.38
  Bottom 0.305: R61.2 20.37,21.26 15.29,26.34 U1.38
5V
  Top 0.305: C3.+ U1.39 12.75,26.5 9.02,22.77 | 5V.1 4.02,17.77 9.02,22.77 | IC2.3 8.94,27.93 8.94,22.85 9.02,22.77
26_GTIN2
  Bottom 0.305: R58.2 24.34,22.85 27.99,26.5 U1.33
27_GTIN1
  Top 0.305: R54.2 20.37,16.18 25.45,21.26 U1.34
29
  Bottom 0.305: 29.1 12.75,9.52 14.02,10.79 14.02,27.29 14.81,28.09 19.1,28.09 20.37,26.82 U1.36
30
  Top 0.305: 30.1 10.21,9.2 8.94,10.47 8.94,17.61 17.83,26.5 U1.37
+12V  (via drill 0.33)
  Top 0.305: C8.2 IC1.4 | +V3.1 +V2.1 6.08,40.63 | 6.08,40.63 v8.78,43.33 | 6.08,40.63 +V.1 6.4,33.8 8.94,31.26 C1.+
  Bottom 0.305: C1.+ 3.86,30.47 IC2.1 | C8.2 47.36,86.35 46.09,87.62 42.12,87.62 34.34,79.84 34.34,58.09 26.72,50.47 15.93,50.47 v8.78,43.33
-5VREF  (via drill 0.33)
  Top 0.305: C29.- IC7.3 26.4,30.47 27.51,31.58 27.51,34.76 C6.2 24.18,39.36 R7.1 | R29.1 51.96,35.39 50.53,35.39 50.38,35.55 R13.1 47.04,35.87 v41.48,41.42 | R49.1 R53.1 22.91,43.01 25.29,40.63 R7.1 | R7.1 IC8.1 | R24.1 R26.1 | v50.22,62.54 48.95,62.54 47.99,63.49 R71.1 46.09,63.49 44.82,62.22 40.69,62.22 | R33.1 R43.1 R41.1 22.91,74.92 | R37.1 22.91,74.92 | 40.69,62.22 36.56,62.22 35.93,61.59 35.29,61.59 34.34,62.54 34.34,70.16 29.58,74.92 22.91,74.92 | 40.69,62.22 v40.69,61.9
  Bottom 0.305: -5V.1 1.96,20.31 12.12,30.47 C29.- | 40.69,41.42 28.79,41.42 IC8.1 | 40.69,41.42 v41.48,41.42 | v50.22,62.54 51.17,62.54 R67.1 | R26.1 17.83,103.18 11.48,96.83 11.48,82.54 R33.1 | v40.69,61.9 40.69,41.42
-12V  (via drill 0.33)
  Top 0.305: C2.- 3.86,51.27 1.32,48.73 -V3.1 -V2.1 -V.1 9.73,45.71 14.81,40.63 R7.2 18.15,40.63 26.09,32.69 IC7.2 | IC1.11 C9.1 47.36,73.65 46.09,72.38 45.45,72.38 v35.61,62.54
  Bottom 0.305: v35.61,62.54 35.61,54.92 26.72,46.03 26.72,45.39 21.96,40.63 R7.2
ADC0  (via drill 0.33)
  Top 0.305: IC4.1 R21.2 31.8,95.24 C16.2 | v51.96,24.91 53.55,24.91 55.3,26.66 55.93,26.66 U1.22
  Bottom 0.305: v51.96,24.91 51.96,24.28 49.58,21.9 49.58,21.26 51.33,19.52 56.57,19.52 64.6,27.55 64.6,77.84 47.2,95.24 C16.2
ADC1  (via drill 0.33)
  Top 0.305: C17.2 8.94,92.7 R25.2 IC4.7 | v42.91,28.72 50.69,28.72 52.76,26.66 53.39,26.66 U1.23 | v34.5,37.14 34.5,54.76 31.96,57.3 v31.8,57.3
  Bottom 0.305: v34.5,37.14 v42.91,28.72 | v31.8,57.3 31.8,94.29 23.23,102.86 20.05,102.86 14.02,96.83 14.02,95.24 IC4.7
ADC2  (via drill 0.33)
  Top 0.305: C20.2 8.94,85.08 R30.2 IC4.8 14.66,88.25 18.31,88.25 19.1,87.46 19.1,85.24 21.8,82.54 23.23,82.54 v35.29,70.47 | v50.85,36.34 47.99,36.34 44.34,40 v44.34,41.74
  Bottom 0.305: v50.85,36.34 U1.24 | v44.34,41.74 43.23,42.85 43.23,60.63 35.29,68.57 v35.29,70.47
ADC3  (via drill 0.33)
  Top 0.305: IC4.14 R34.2 31.8,85.08 C21.2 | v50.85,44.28 50.85,56.19 52.91,58.25 54.66,58.25 v55.93,59.52
  Bottom 0.305: U1.25 48.31,35.23 50.85,37.77 v50.85,44.28 | v55.93,59.52 55.93,69.52 52.12,73.33 52.12,89.21 48.63,92.7 40.69,92.7 C21.2
ADC4  (via drill 0.33)
  Top 0.305: IC5.1 R38.2 31.8,64.76 C22.2 | v32.59,38.41 32.59,44.6 v25.77,51.43
  Bottom 0.305: U1.26 45.77,27.14 34.5,38.41 v32.59,38.41 | v25.77,51.43 25.77,52.06 26.72,53.01 26.72,62.22 IC5.1
ADC5  (via drill 0.33)
  Top 0.305: C23.2 8.94,64.76 R42.2 IC5.7 14.66,61.59 17.04,61.59 21.64,56.98 21.64,53.01 22.59,52.06 23.23,52.06 31.17,44.12 31.17,38.57 32.44,37.3 v32.59,37.3
  Bottom 0.305: v32.59,37.3 43.23,26.66 U1.27
ADC6  (via drill 0.33)
  Top 0.305: C24.2 8.94,54.6 R46.2 IC5.8 | v14.02,52.06 v16.56,49.52 | v26.56,34.12 v16.56,44.12
  Bottom 0.305: v26.56,34.12 31.8,28.88 31.8,26.02 32.59,25.23 38.63,25.23 40.06,26.66 40.69,26.66 U1.28 | v16.56,49.52 v16.56,44.12 | v14.02,52.06 14.02,54.6 IC5.8
ADC7  (via drill 0.33)
  Top 0.305: IC5.14 R50.2 31.8,54.6 C25.2 | v29.26,35.55 29.26,38.41 28.63,39.04 28.63,39.68 29.26,40.31 29.26,40.95 25.77,44.44 24.66,44.44 v24.18,44.92
  Bottom 0.305: v29.26,35.55 38.15,26.66 U1.29 | v24.18,44.92 24.18,46.03 32.75,54.6 C25.2
ADC8
  Top 0.305: IC3.1 R8.2 38.15,44.44 C7.2 35.61,43.17 U1.30
ADC9  (via drill 0.33)
  Top 0.305: IC3.7 R15.2 61.01,44.44 C10.2 | v59.27,31.74 60.06,30.95 60.06,26.34 57.68,23.96 51.65,23.96 51.49,24.12 31.32,24.12 29.26,26.18 29.26,27.29 30.05,28.09 31.01,28.09 32.44,26.66 33.07,26.66 U1.31
  Bottom 0.305: v59.27,31.74 59.27,33.8 61.01,35.55 61.01,43.17 C10.2
ADC10  (via drill 0.33)
  Top 0.305: IC3.8 R64.2 61.01,54.6 C11.2 | v59.11,30.31 43.23,30.31 41.96,29.04 41.96,26.18 41.01,25.23 32.59,25.23 31.17,26.66 30.53,26.66 U1.32
  Bottom 0.305: v59.11,30.31 63.55,34.76 63.55,53.33 C11.2
ADC11  (via drill 0.33)
  Top 0.305: C14.2 38.15,54.6 R68.2 IC3.14 | v33.55,44.44 33.55,36.5 26.88,29.83 26.72,29.83 23.55,26.66 22.91,26.66 U1.35
  Bottom 0.305: v33.55,44.44 39.42,50.31 R68.2
AINL
  Top 0.305: U1.16 R10.2
AINR
  Top 0.305: U1.17 R9.2
AOUTL
  Top 0.305: U1.18 R18.1
AOUTR
  Top 0.305: U1.19 R17.1
N$1
  Bottom 0.305: R27.1 15.29,102.35 1.83,88.89 CV2A.1
N$2
  Top 0.305: AINR2.1 R4.1
N$3
  Top 0.305: AINL2.1 R6.1
N$4
  Top 0.305: C4.1 R3.1 IC1.2 53.39,83.97 61.01,91.59 | R2.2 61.01,91.59 | 61.01,91.59 R4.2
N$5
  Top 0.305: C5.1 R5.1 IC1.6 43.39,83.81 45.3,81.91 61.01,81.91 | R1.2 61.01,81.91 | 61.01,81.91 R6.2
N$6
  Top 0.305: AINR1.1 R2.1
N$7
  Top 0.305: AINL1.1 R1.1
N$8
  Top 0.305: C7.1 38.15,39.36 38.23,39.28 | R8.1 38.23,39.28 | R11.2 R12.2 40.53,41.74 40.53,41.58 38.23,39.28 | R11.2 IC3.2 | R11.2 R13.2
N$9  (via drill 0.33)
  Top 0.305: IC1.7 R5.2 C5.2 | v46.09,42.06 v46.09,39.52
  Bottom 0.305: R10.1 48.31,24.75 47.04,26.02 47.04,33.96 45.77,35.23 45.77,39.2 v46.09,39.52 | v46.09,42.06 46.09,42.54 45.77,42.85 45.77,60.63 43.23,63.17 43.23,73.81 41.96,75.08 41.96,82.54 IC1.7
N$10
  Top 0.305: IC1.1 R3.2
  Bottom 0.305: R9.1 51.8,21.58 53.07,20.31 56.25,20.31 57.2,21.26 57.2,33.96 58.47,35.23 58.47,36.03 58.31,36.19 58.31,42.69 58.47,42.85 58.47,72.06 57.2,73.33 57.2,82.54 IC1.1 | R3.2 C4.2
N$11
  Top 0.305: AOUTR1.1 R19.2
N$12
  Top 0.305: C12.2 R14.2 IC1.8 42.6,78.09 48.79,78.09 49.58,77.3 49.58,73.33 47.04,70.79 47.04,68.25 49.26,66.03 R19.1
N$13  (via drill 0.33)
  Top 0.305: R12.1 42.91,35.55 45.77,32.69 60.85,32.69 v65.61,37.46
  Bottom 0.305: v65.61,37.46 65.61,41.27 66.17,41.82 66.41,42.06 67.52,43.17 CV9B.1
N$14
  Top 0.305: R11.1 45.45,35.55 47.52,33.49 60.38,33.49 67.52,40.63 CV9A.1
N$15
  Top 0.305: R16.2 C13.2 | R16.2 IC1.14 | R16.2 R20.1
N$16
  Top 0.305: C10.1 61.01,38.09 R15.1 R62.2 | R62.2 R29.2 | R62.2 R63.2 | R62.2 IC3.6
N$17
  Top 0.305: C13.1 R16.1 IC1.13
  Bottom 0.305: R18.2 53.39,24.75 52.12,26.02 52.12,33.96 53.39,35.23 53.39,59.36 53.07,59.68 53.07,62.86 53.39,63.17 53.39,68.57 C13.1
N$18
  Top 0.305: R62.1 55.61,35.55 56.88,34.28 59.9,34.28 66.57,40.95 66.57,43.65 CV10A.1
N$19
  Top 0.305: R63.1 60.06,35.55 65.3,40.79 65.3,44.92 CV10B.1
N$20  (via drill 0.33)
  Top 0.305: v54.03,60 45.77,68.25 C12.1 | R14.1 IC1.9
  Bottom 0.305: R17.2 55.93,24.91 54.66,26.18 54.66,33.96 55.93,35.23 55.93,58.09 v54.03,60 | C12.1 R14.1
N$21
  Top 0.305: AOUTL1.1 R20.2
N$22
  Top 0.305: R22.1 27.04,104.13 21.96,99.05 7.35,99.05 2.27,93.97 CV1A.1
N$23
  Top 0.305: 14_RX.1 50.85,6.34 45.77,11.42 U1.15
N$24
  Top 0.305: C16.1 31.8,100.32 31.72,100.4 | R21.1 31.72,100.4 | R23.2 IC4.2 | R23.2 R24.2 | R23.2 27.83,96.51 | 27.83,96.51 31.72,100.4 | 27.83,96.51 R22.2
N$25
  Top 0.305: R59.1 67.36,20.31 GTIN2.1
N$26  (via drill 0.33)
  Top 0.305: v4.18,93.05 4.18,89.21 CV2B.1
  Bottom 0.305: v4.18,93.05 4.69,93.05 12.75,101.11 R28.1
N$27  (via drill 0.33)
  Top 0.305: R23.1 24.5,104.13 20.37,100 v8.31,100
  Bottom 0.305: v8.31,100 2.59,94.29 2.59,92.7 CV1B.1
N$28
  Top 0.305: 13_TX.1 48.31,6.18 43.23,11.26 U1.14
N$29
  Top 0.305: R27.2 R28.2 11.48,97.78 C17.1 | R27.2 IC4.6 | R27.2 R26.2
  Bottom 0.305: R25.1 10.21,100.32 C17.1
N$30
  Top 0.305: C21.1 31.8,78.73 R34.1 R36.2 | R36.2 R37.2 | R36.2 R35.2 | R36.2 IC4.13
N$31  (via drill 0.33)
  Top 0.305: v21.64,84.92 21.64,87.46 20.05,89.05 10.05,89.05 2.59,81.59 2.59,80 CV4A.1
  Bottom 0.305: R35.1 27.99,77.14 21.64,83.49 v21.64,84.92
N$32
  Top 0.305: R36.1 24.5,76.19 23.23,77.46 2.59,77.46 CV4B.1
N$33
  Top 0.305: 10_MOSI.1 40.69,6.34 35.61,11.42 U1.11
N$34
  Bottom 0.305: R32.1 14.34,76.19 13.07,74.92 7.67,74.92 CV3B.1
N$35
  Bottom 0.305: R31.1 8.94,76.19 CV3A.1
N$36
  Top 0.305: C20.1 8.94,80 9.02,79.92 | R30.1 9.02,79.92 | R32.2 12.91,83.81 | R32.2 R33.2 | R32.2 IC4.9 | 12.91,83.81 9.02,79.92 | 12.91,83.81 R31.2
N$37
  Top 0.305: 9_MISO.1 38.15,6.18 33.07,11.26 U1.10
N$38
  Top 0.305: C22.1 31.8,69.84 31.72,69.92 | R38.1 31.72,69.92 | R40.2 IC5.2 | R40.2 R41.2 | R40.2 27.83,66.03 | 27.83,66.03 31.72,69.92 | 27.83,66.03 R39.2
N$39
  Top 0.305: 8_SCK.1 35.61,6.34 30.53,11.42 U1.9
N$40
  Top 0.305: R40.1 24.5,73.65 23.23,72.38 2.59,72.38 CV5B.1
N$41  (via drill 0.33)
  Top 0.305: R39.1 27.04,73.65 23.23,69.84 19.58,69.84 v17.99,71.43 | v14.34,74.92 2.59,74.92 CV5A.1
  Bottom 0.305: v17.99,71.43 17.99,71.9 16.56,73.33 16.56,73.97 15.61,74.92 v14.34,74.92
N$42
  Top 0.305: 7_CS.1 33.07,6.18 27.99,11.26 U1.8
N$43
  Top 0.305: C23.1 8.94,69.84 9.02,69.92 | R42.1 9.02,69.92 | R44.2 12.91,66.03 | R44.2 IC5.6 | R44.2 R43.2 | 12.91,66.03 9.02,69.92 | 12.91,66.03 R45.2
N$44  (via drill 0.33)
  Top 0.305: v4.66,67.3 2.59,67.3 CV6A.1
  Bottom 0.305: R44.1 14.34,73.65 7.99,67.3 v4.66,67.3
N$45
  Bottom 0.305: R45.1 8.46,73.65 1.32,66.51 CV6B.1
N$46
  Top 0.305: C25.1 31.8,48.25 R50.1 R52.2 | R52.2 R53.2 | R52.2 R51.2 | R52.2 IC5.13
N$47
  Top 0.305: 6_SD_CLK.1 30.53,6.34 25.45,11.42 U1.7
N$48  (via drill 0.33)
  Top 0.305: R51.1 22.28,51.43 22.12,51.43 19.1,54.44 19.1,56.98 16.4,59.68 v3.86,59.68
  Bottom 0.305: CV8A.1 2.59,59.68 v3.86,59.68
N$49  (via drill 0.33)
  Top 0.305: R52.1 24.66,45.71 23.39,46.98 17.51,46.98 16.56,46.03 16.56,45.39 15.61,44.44 14.97,44.44 14.02,45.39 14.02,47.62 v11.16,50.47
  Bottom 0.305: v11.16,50.47 8.31,50.47 2.91,55.87 CV8B.1
N$50
  Top 0.305: R48.1 10.85,45.71 8.31,48.25 7.35,48.25 5.13,50.47 5.13,57.14 CV7B.1
N$51  (via drill 0.33)
  Top 0.305: R47.1 15.29,49.2 v12.59,51.9
  Bottom 0.305: v12.59,51.9 6.08,58.41 6.08,58.73 CV7A.1
N$52
  Top 0.305: C24.1 8.94,49.52 9.02,49.44 | R46.1 9.02,49.44 | R47.2 R48.2 10.21,50.79 10.21,50.63 9.02,49.44 | R47.2 R49.2 | R47.2 IC5.9
N$53
  Top 0.305: 5_SD_CMD.1 27.99,6.18 22.91,11.26 U1.6
N$54
  Top 0.305: R55.1 67.36,17.77 GTIN1.1
N$55
  Top 0.305: Q1.2 34.98,14.6 R56.2 R55.2
N$56
  Top 0.305: R57.1 27.99,16.5 | 27.99,16.5 R54.1 | 27.99,16.5 Q1.1
N$57
  Top 0.305: C14.1 38.15,59.68 38.23,59.76 | R68.1 38.23,59.76 | R69.2 IC3.13 | R69.2 42.12,55.87 | R69.2 R71.2 | 42.12,55.87 38.23,59.76 | 42.12,55.87 R70.2
N$58
  Top 0.305: Q2.2 34.98,20.94 R59.2 R60.2
N$59
  Top 0.305: R61.1 R58.1 Q2.1
N$60  (via drill 0.33)
  Top 0.305: v48.63,59.36 48.95,59.05 54.34,59.05 54.98,59.68 54.98,61.59 53.39,63.17 53.39,63.81 54.34,64.76 59.74,64.76 60.06,64.76 62.28,64.76 67.36,59.68 67.36,57.14 CV12A.1
  Bottom 0.305: v48.63,59.36 R69.1
N$61
  Top 0.305: 4_SD_D0.1 25.45,6.34 20.37,11.42 U1.5
N$62
  Top 0.305: 3_SD_D1.1 22.91,6.18 17.83,11.26 U1.4
N$63
  Top 0.305: 2_SD_D2.1 20.37,6.34 15.29,11.42 U1.3
N$64
  Top 0.305: 1_SD_D3.1 17.83,6.18 12.75,11.26 U1.2
N$65
  Top 0.305: 0.1 15.29,6.34 10.21,11.42 U1.1
N$66
  Top 0.305: 11.1 43.23,6.18 38.15,11.26 U1.12
N$67
  Top 0.305: 12.1 45.77,6.34 40.69,11.42 U1.13
N$68  (via drill 0.33)
  Top 0.305: R70.1 42.91,63.49 44.18,64.76 47.99,64.76 v49.26,63.49 | v49.26,67.3 61.33,67.3 68.63,60 CV12B.1
  Bottom 0.305: v49.26,67.3 v49.26,63.49
N$69
  Top 0.305: R66.1 59.74,63.49 60.22,63.49 62.28,63.49 66.09,59.68 66.09,55.87 CV11B.1
N$70
  Top 0.305: CV11A.1 64.82,54.6 64.82,59.68 62.13,62.37 56.74,62.37 55.62,63.49 R65.1
N$71
  Top 0.305: C11.1 61.01,59.68 60.93,59.76 | R64.1 60.93,59.76 | R65.2 R67.2 | R65.2 IC3.9 | R65.2 57.04,55.87 | 57.04,55.87 60.93,59.76 | 57.04,55.87 R66.2
PE
  Top 0.305: U1.40 10.21,31.74 C1.-
  Bottom 0.305: IC3.3 47.29,45.71
  pour Bottom: 69.9,-0.01 0.05,-0.01 0.05,105.4 69.9,105.4

### Text on the board
tNames: Rob Ellis 2020